# EAGLE design esp32 (EAGLE 9.6.2)
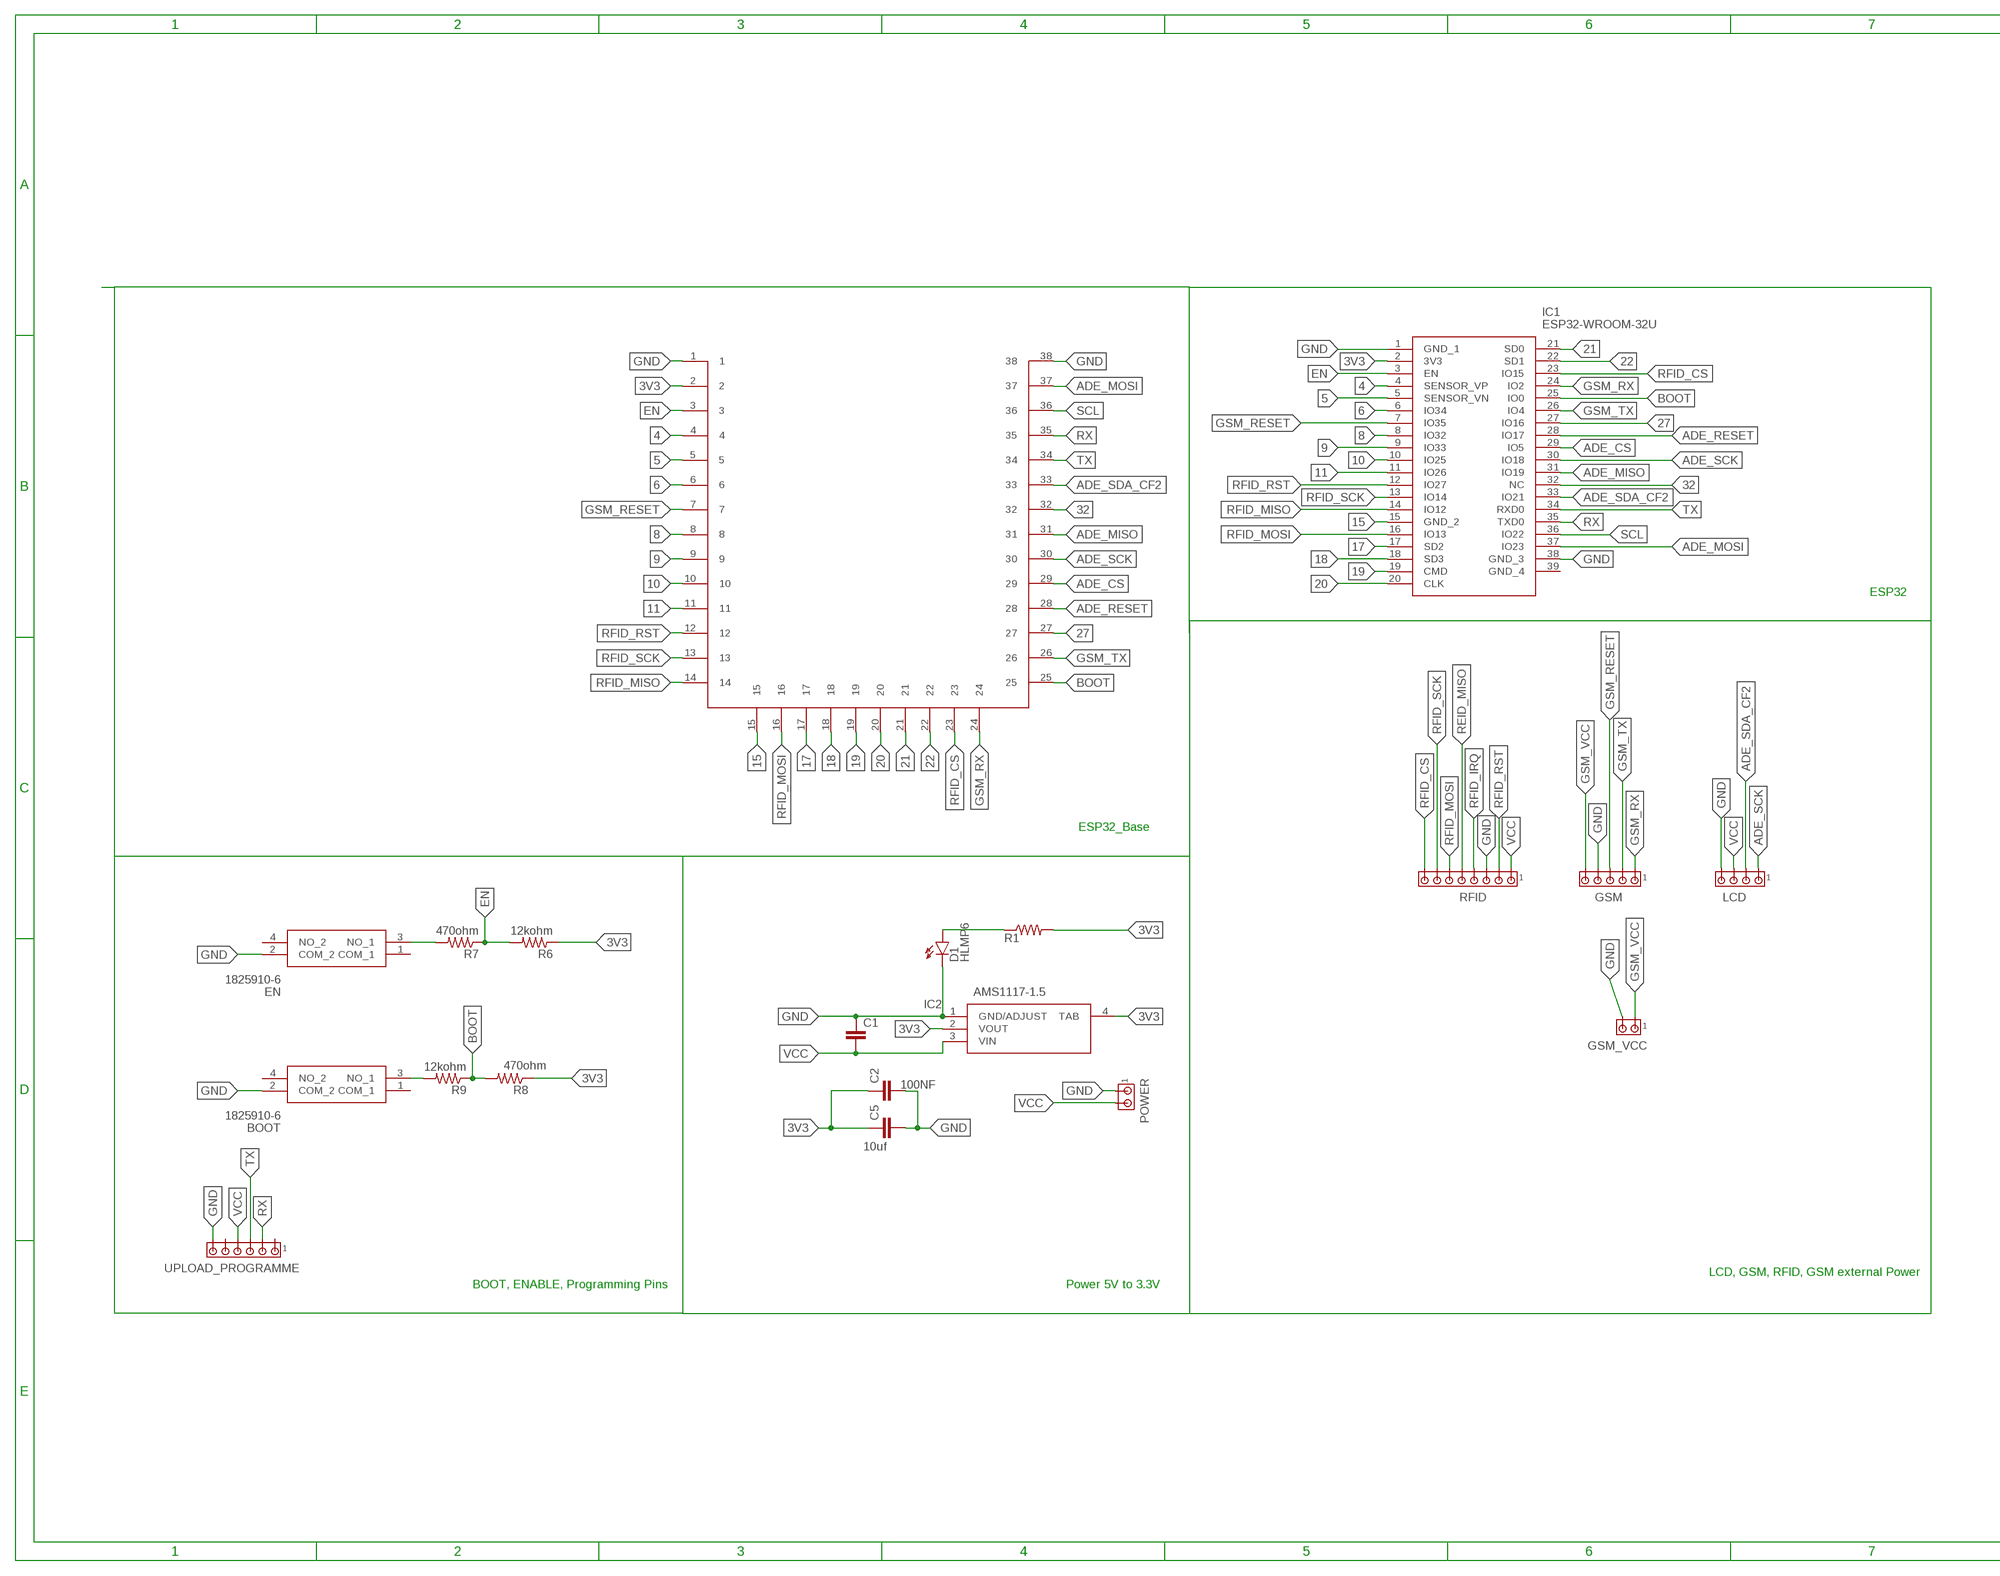
[diagram p0: schematic, sheet 1, part 1 of 2]
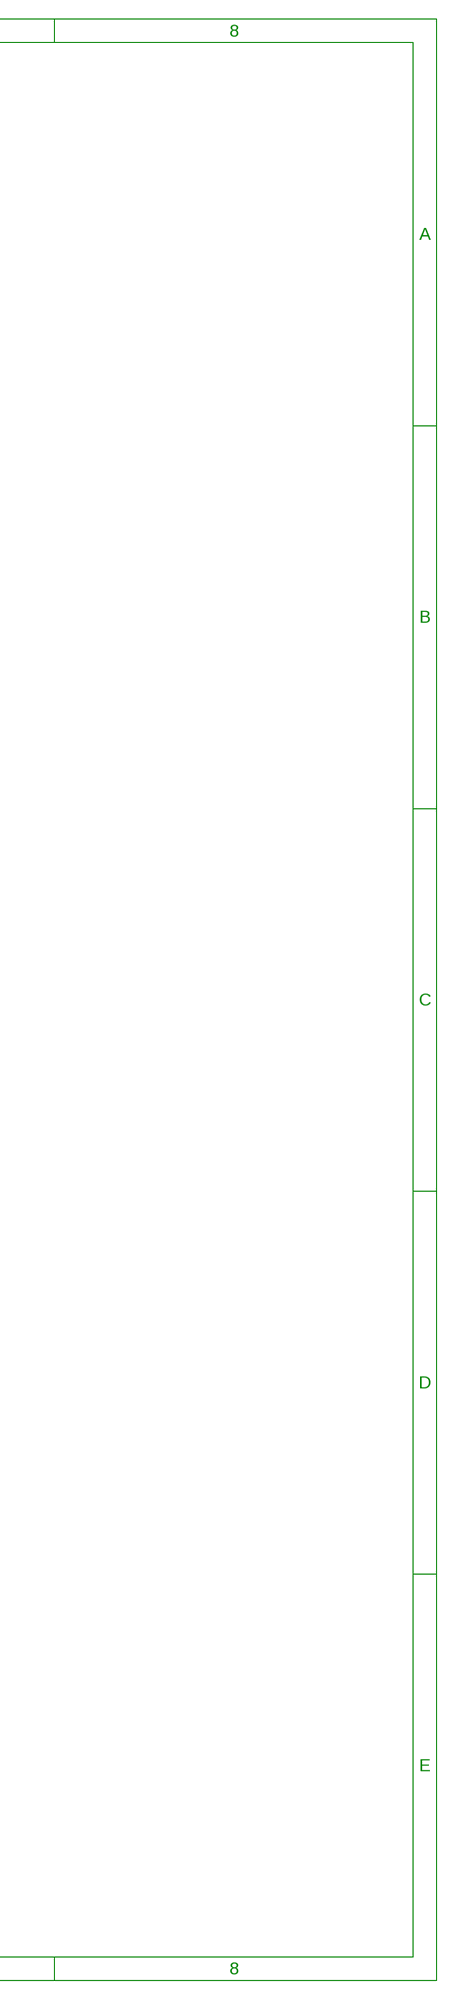
[diagram p1: schematic, sheet 1, part 2 of 2]

## Parts
BOOT  1825910-6  [18259106]
C1  C2,5-3  [C2.5-3]
C2  100NF  C2,5-3  [C2.5-3]
C5  10uf  C2,5-3  [C2.5-3]
D1  HLMP6  [HLMP6]
EN  1825910-6  [18259106]
GSM  MTA05-156  [1X5MTA]
GSM_VCC  MTA02-156  [1X2MTA]
IC1  ESP32-WROOM-32U  [ESP32WROOM32D]
IC2  AMS1117-1.5  [SOT229P700X180-4N]
LCD  MTA04-156  [1X4MTA]
POWER  MTA02-156  [1X2MTA]
R1  R-US_0204/7  [0204/7]
R6  12kohm  2-2176053-0  [RESC2012X65N]
R7  470ohm  2-2176053-0  [RESC2012X65N]
R8  470ohm  2-2176053-0  [RESC2012X65N]
R9  12kohm  2-2176053-0  [RESC2012X65N]
RFID  MTA08-156  [1X8MTA]
U$1  LIB1SHIV_KUMAR  [1X14MTA]
UPLOAD_PROGRAMME  MTA06-156  [1X6MTA]

## Nets
3V3: C2.1 C5.1 IC1.2(3V3) IC2.2(VOUT) IC2.4(TAB) R1.2 R6.1 R8.1 U$1.2
4: IC1.4(SENSOR_VP) U$1.4
5: IC1.5(SENSOR_VN) U$1.5
6: IC1.6(IO34) U$1.6
8: IC1.8(IO32) U$1.8
9: IC1.9(IO33) U$1.9
10: IC1.10(IO25) U$1.10
11: IC1.11(IO26) U$1.11
15: IC1.15(GND_2) U$1.15
17: IC1.17(SD2) U$1.17
18: IC1.18(SD3) U$1.18
19: IC1.19(CMD) U$1.19
20: IC1.20(CLK) U$1.20
21: IC1.21(SD0) U$1.21
22: IC1.22(SD1) U$1.22
27: IC1.27(IO16) U$1.27
32: IC1.32(NC) U$1.32
ADE_CS: IC1.29(IO5) U$1.29
ADE_MISO: IC1.31(IO19) U$1.31
ADE_MOSI: IC1.37(IO23) U$1.37
ADE_RESET: IC1.28(IO17) U$1.28
ADE_SCK: IC1.30(IO18) LCD.1 U$1.30
ADE_SDA_CF2: IC1.33(IO21) LCD.2 U$1.33
BOOT: IC1.25(IO0) R8.2 R9.1 U$1.25
EN: IC1.3(EN) R6.2 R7.1 U$1.3
GND: BOOT.2(COM_2) C1.1 C2.2 C5.2 D1.K EN.2(COM_2) GSM.4 GSM_VCC.2 IC1.1(GND_1) IC1.38(GND_3) IC2.1(GND/ADJUST) LCD.4 POWER.1 RFID.3 U$1.1 U$1.38 UPLOAD_PROGRAMME.6
GSM_RESET: GSM.3 IC1.7(IO35) U$1.7
GSM_RX: GSM.1 IC1.24(IO2) U$1.24
GSM_TX: GSM.2 IC1.26(IO4) U$1.26
GSM_VCC: GSM.5 GSM_VCC.1
N$23: EN.3(NO_1) R7.2
N$39: BOOT.3(NO_1) R9.2
N$41: D1.A R1.1
REID_MISO: RFID.5
RFID_CS: IC1.23(IO15) RFID.8 U$1.23
RFID_IRQ: RFID.4
RFID_MISO: IC1.14(IO12) U$1.14
RFID_MOSI: IC1.16(IO13) RFID.6 U$1.16
RFID_RST: IC1.12(IO27) RFID.2 U$1.12
RFID_SCK: IC1.13(IO14) RFID.7 U$1.13
RX: IC1.35(TXD0) U$1.35 UPLOAD_PROGRAMME.2
SCL: IC1.36(IO22) U$1.36
TX: IC1.34(RXD0) U$1.34 UPLOAD_PROGRAMME.3
VCC: C1.2 IC2.3(VIN) LCD.3 POWER.2 RFID.1 UPLOAD_PROGRAMME.4
Unconnected: BOOT.1(COM_1) BOOT.4(NO_2) EN.1(COM_1) EN.4(NO_2) IC1.39(GND_4) UPLOAD_PROGRAMME.1 UPLOAD_PROGRAMME.5

## Notes on the sheet
- ESP32
- ESP32_Base
- LCD, GSM, RFID, GSM external Power
- BOOT, ENABLE, Programming Pins | Power 5V to 3.3V

## Library data of the parts
BOOT EN = 1825910-6:1825910-6: FSM4JH=6MM TACT SWITCH, HIGH TEMP Source: Datasheet <https://www.te.com/commerce/DocumentDelivery/DDEController?Action=srchrtrv&DocNm=1825910&DocType=Customer Drawing&DocLang=English&DocFormat=pdf&PartCntxt=1825910-6>; ARROW_PART_NUMBER: 1825910-6; ARROW_PRICE-STOCK: https://www.arrow.com/en/products/1825910-6/te-connectivity?region=europe; DESCRIPTION: FSM4JH=6MM TACT SWITCH, HIGH TEMP; HEIGHT: 5.3mm; MANUFACTURER_NAME: TE Connectivity; MANUFACTURER_PART_NUMBER: 1825910-6; MF: ALCOSWITCH - TE CONNECTIVITY; MOUSER_PART_NUMBER: N/A; MOUSER_PRICE-STOCK: https://www.mouser.co.uk/ProductDetail/TE-Connectivity/1825910-6?qs=A6cQTCBcXncisYDS1KbpGA%3D%3D; MPN: FSM4JH; OC_FARNELL: 1555982
C1 C2 C5 = capacitor-wima:C: CAPACITOR naming: grid - package width
D1 = display-hp:HLMP6: LED 2mm horizontal; MF: AGILENT TECHNOLOGIES; MPN: HLMP-6500; OC_FARNELL: 1652490; OC_NEWARK: 40K0088
GSM = con-amp:MTA05-156: AMP connector
GSM_VCC POWER = con-amp:MTA02-156: AMP connector
IC1 = ESP32-WROOM-32U:ESP32-WROOM-32U: WiFi Modules (802.11) SMD Module, ESP32-D0WD, 32Mbits SPI flash, UART mode, U.FL antenna connector Source: Datasheet <https://www.mouser.de/datasheet/2/891/esp32-wroom-32d_esp32-wroom-32u_datasheet_en-1365844.pdf>; DESCRIPTION: WiFi Modules (802.11) SMD Module, ESP32-D0WD, 32Mbits SPI flash, UART mode, U.FL antenna connector; HEIGHT: 3.1mm; MANUFACTURER_NAME: Espressif Systems; MANUFACTURER_PART_NUMBER: ESP32-WROOM-32U; MOUSER_PART_NUMBER: 356-ESP32-WROOM-32U; OC_FARNELL: unknown
IC2 = AMS1117-1.5:AMS1117-1.5: 1A LOW DROPOUT VOLTAGE REGULATOR Source: Datasheet <http://www.advanced-monolithic.com/pdf/ds1117.pdf>; DESCRIPTION: 1A LOW DROPOUT VOLTAGE REGULATOR; HEIGHT: 1.8mm; MANUFACTURER_NAME: ams; MANUFACTURER_PART_NUMBER: AMS1117-1.5; OC_FARNELL: unknown
LCD = con-amp:MTA04-156: AMP connector
R1 = rcl:R-US_: RESISTOR, American symbol; SPICEPREFIX: R
R6-R9 = 2-2176053-0:2-2176053-0: RLP73N 2A R33 1% 1K RL Check availability <https://pricing.snapeda.com/parts/2-2176053-0/TE%20Connectivity/view-part?ref=eda>; AVAILABILITY: In Stock; COMMENT: 2-2176053-0; DESCRIPTION: RES 0.33 OHM 1% 1/4W 0805; EU_ROHS_COMPLIANCE: Compliant with Exemptions; MF: TE Connectivity; MP: 2-2176053-0; PACKAGE: 0805; PRICE: None
RFID = con-amp:MTA08-156: AMP connector
U$1 = ESP_CONN:LIB1
UPLOAD_PROGRAMME = con-amp:MTA06-156: AMP connector

## Board
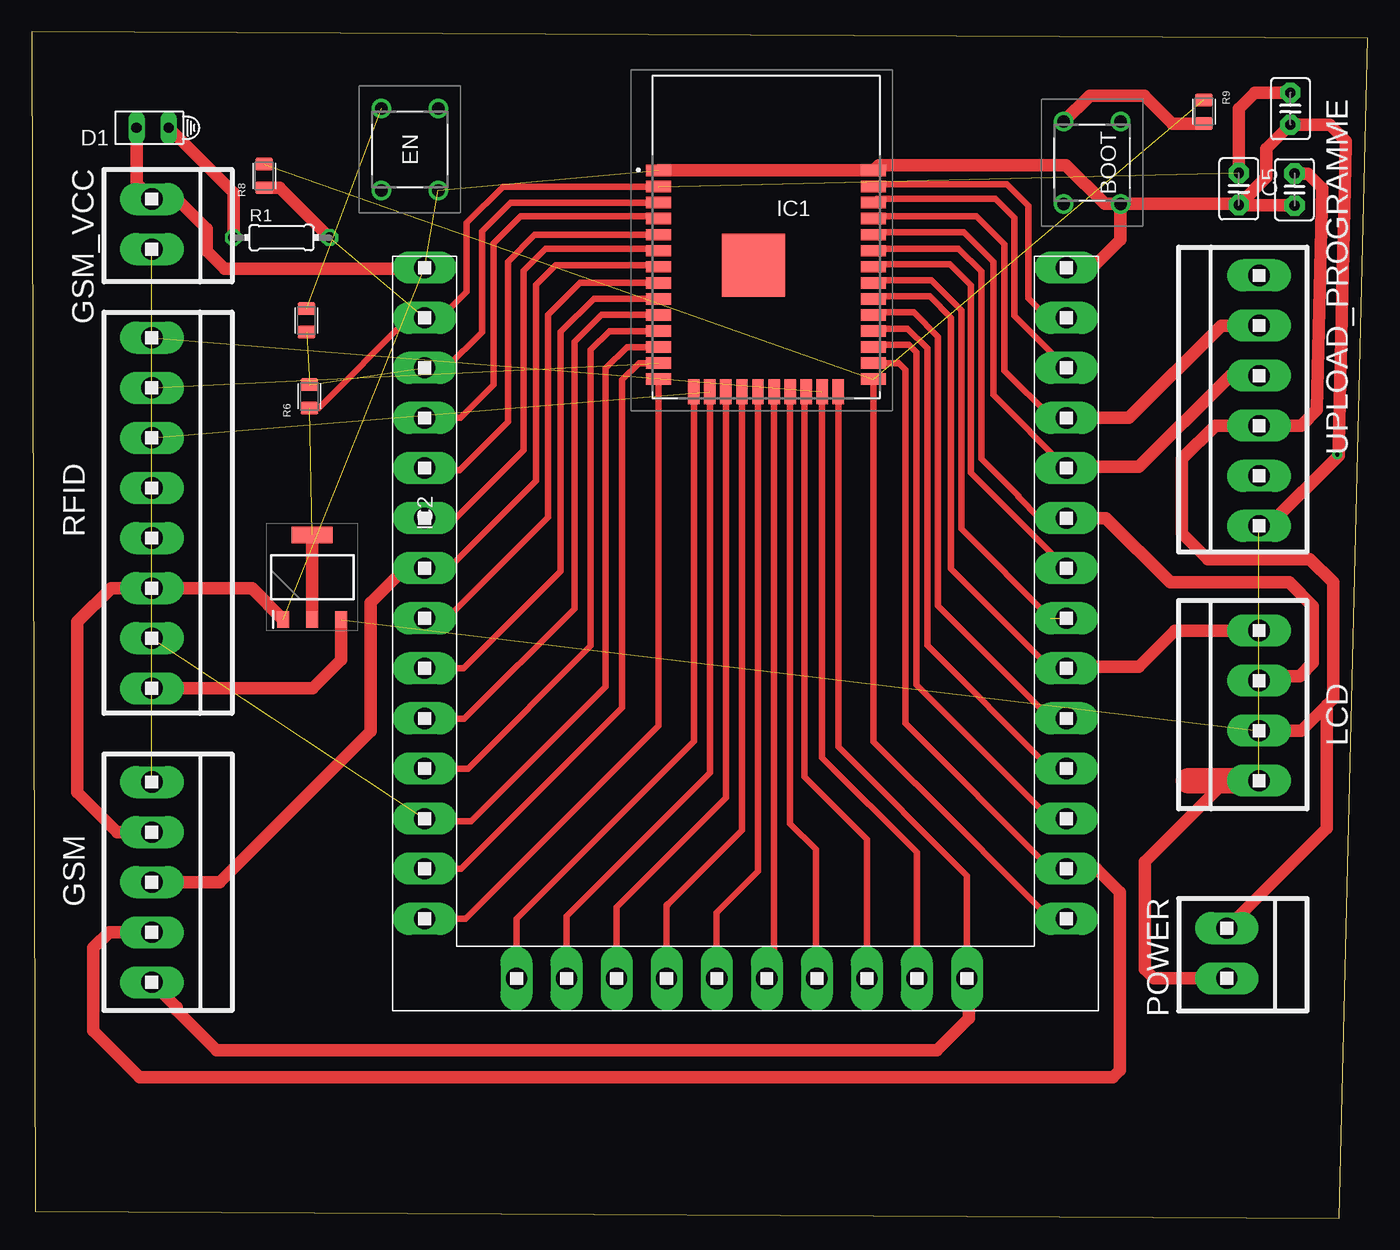
[diagram p2: board, top side]

Size 105.77 x 93.87 mm. Coordinates in mm from the lower left corner, seen from the top.
Outline: 0.27,0.54 103.5,0 105.77,93.33 0,93.87 0.27,0.54
Copper layers (1*16): Top 0.035mm / dielectric 1.5mm / Bottom 0.035mm
Design rules "default": minimum track width 6mil, minimum drill 0.35mm, track to track 6mil, track to pad 6mil, pad to pad 6mil, via to via 6mil, smd to smd 6mil, copper to edge 40mil, drill to drill 6mil, minimum pad ring 10mil, minimum via ring 8mil, stop-mask expansion 4mil, vias tented up to drill 0mil, thermal gap 10mil

### Footprints (pad centres in the part's own frame; a part is rotated, then mirrored left to right if it is on the bottom)
18259106 = drill 0.99 pad 1.54: 1 0,0; 2 6.5,0; 3 0,-4.5; 4 6.5,-4.5
C2.5-3 = drill 0.813 pad 1.6 octagon: 1 -1.27,0; 2 1.27,0
HLMP6 = drill 0.813 long: A -1.27,0; K 1.27,0
1X5MTA = drill 1.676 long: 1 7.925,0; 2 3.962,0; 3 0,0; 4 -3.962,0; 5 -7.925,0
1X2MTA = drill 1.676 long: 1 1.981,0; 2 -1.981,0
ESP32WROOM32D = smd 2 x 0.9: 1 -8.15,5.51; 2 -8.15,4.24; 3 -8.15,2.97; 4 -8.15,1.7; 5 -8.15,0.43; 6 -8.15,-0.84; 7 -8.15,-2.11; 8 -8.15,-3.38; 9 -8.15,-4.65; 10 -8.15,-5.92; 11 -8.15,-7.19; 12 -8.15,-8.46; 13 -8.15,-9.73; 14 -8.15,-11; 25 8.85,-11; 26 8.85,-9.73; 27 8.85,-8.46; 28 8.85,-7.19; 29 8.85,-5.92; 30 8.85,-4.65; 31 8.85,-3.38; 32 8.85,-2.11; 33 8.85,-0.84; 34 8.85,0.43; 35 8.85,1.7; 36 8.85,2.97; 37 8.85,4.24; 38 8.85,5.51 | smd 0.9 x 2: 15 -5.365,-12; 16 -4.095,-12; 17 -2.825,-12; 18 -1.555,-12; 19 -0.285,-12; 20 0.985,-12; 21 2.255,-12; 22 3.525,-12; 23 4.795,-12; 24 6.065,-12 | smd 5 x 5: 39 -0.65,-1.99
SOT229P700X180-4N = smd 1.3 x 0.95: 1 -3.35,2.29; 2 -3.35,0; 3 -3.35,-2.29 | smd 1.3 x 3.25: 4 3.35,0
1X4MTA = drill 1.676 long: 1 5.944,0; 2 1.981,0; 3 -1.981,0; 4 -5.944,0
0204/7 = drill 0.813 octagon: 1 -3.81,0; 2 3.81,0
RESC2012X65N = smd 1 x 1.42: 1 -0.935,0; 2 0.935,0
1X8MTA = drill 1.676 long: 1 13.868,0; 2 9.906,0; 3 5.944,0; 4 1.981,0; 5 -1.981,0; 6 -5.944,0; 7 -9.906,0; 8 -13.868,0
1X14MTA = drill 1.676 long: 1 -27.94,23.216; 2 -27.94,19.253; 3 -27.94,15.291; 4 -27.94,11.328; 5 -27.94,7.366; 6 -27.94,3.404; 7 -27.94,-0.559; 8 -27.94,-4.521; 9 -27.94,-8.484; 10 -27.94,-12.446; 11 -27.94,-16.408; 12 -27.94,-20.371; 13 -27.94,-24.333; 14 -27.94,-28.296; 15 -20.676,-33.02; 16 -16.713,-33.02; 17 -12.751,-33.02; 18 -8.788,-33.02; 19 -4.826,-33.02; 20 -0.864,-33.02; 21 3.099,-33.02; 22 7.061,-33.02; 23 11.024,-33.02; 24 14.986,-33.02; 25 22.86,-28.296; 26 22.86,-24.333; 27 22.86,-20.371; 28 22.86,-16.408; 29 22.86,-12.446; 30 22.86,-8.484; 31 22.86,-4.521; 32 22.86,-0.559; 33 22.86,3.404; 34 22.86,7.366; 35 22.86,11.328; 36 22.86,15.291; 37 22.86,19.253; 38 22.86,23.216
1X6MTA = drill 1.676 long: 1 9.906,0; 2 5.944,0; 3 1.981,0; 4 -1.981,0; 5 -5.944,0; 6 -9.906,0

### Placement (x,y rotation side)
BOOT  86.18,86.74 270 top
C1  99.96,81.37 90 top
C2  99.63,87.77 270 top
C5  95.55,81.42 270 top
D1  9.58,86.26 180 top
EN  32.19,87.8 270 top
GSM  9.52,26.57 270 top
GSM_VCC  9.52,78.64 270 top
IC1  57.78,77.37 0 top
IC2  22.22,50.7 90 top
LCD  97.15,40.54 90 top
POWER  94.6,20.95 270 top
R1  19.79,77.57 0 top
R6  21.99,65.01 90 top
R7  21.76,71.02 90 top
R8  18.41,82.45 90 top
R9  92.79,87.53 270 top
RFID  9.52,55.78 270 top
U$1  59.05,51.97 0 top
UPLOAD_PROGRAMME  97.15,64.67 90 top

### Tracks (layer width: path | path; a pad name or v marks a point on that pad's centre or on a via)
3V3  (3 unrouted)
  Top 0.5: IC1.2 37.3,81.61 34.44,78.75 34.44,73.3 32.37,71.22 U$1.2 29.85,71.22 22.7,64.08 R6.1
  Top 1: C2.1 96.81,89.04 95.55,87.78 C5.1 | IC2.2 IC2.4 | R8.1 19.65,81.52 R1.2
4
  Top 0.5: IC1.4 49.56,79.07 49.38,79.24 38.7,79.24 36.58,77.12 36.58,65.94 33.94,63.3 U$1.4
5
  Top 0.5: IC1.5 39.83,77.8 37.7,75.68 37.7,63 33.86,59.16 30.62,59.16 30.8,59.34 U$1.5
6
  Top 0.5: IC1.6 49.47,76.69 40.67,76.69 38.95,74.96 38.95,60.74 33.53,55.33 30.57,55.33 30.61,55.37 U$1.6
8
  Top 0.5: IC1.8 43.39,73.99 40.87,71.47 40.87,55.45 32.76,47.34 31.22,47.34 U$1.8
9
  Top 0.5: IC1.9 44.5,72.72 41.89,70.11 41.89,51.16 34.21,43.49 U$1.9
10
  Top 0.5: IC1.10 45.1,71.45 42.98,69.33 42.98,48.22 34.24,39.49 31.15,39.49 U$1.10
11
  Top 0.5: IC1.11 45.75,70.18 44.25,68.68 44.25,45.27 34.53,35.55 31.13,35.55 U$1.11
15
  Top 0.5: IC1.15 52.41,37.72 38.37,23.68 U$1.15
17
  Top 0.5: IC1.17 54.95,33.24 46.3,24.58 U$1.17
18
  Top 0.5: IC1.18 56.22,30.69 50.41,24.88 50.26,24.73 | 50.24,20.1 50.24,24.7 50.26,24.73 | U$1.18 50.26,24.73
19
  Top 0.5: IC1.19 57.5,27.43 54.22,24.16 U$1.19
20
  Top 0.5: IC1.20 58.77,19.53 U$1.20
21
  Top 0.5: IC1.21 60.03,31.19 62.07,29.16 62.07,19.03 U$1.21
22
  Top 0.5: IC1.22 61.18,65.25 61.18,34.91 66.11,29.99 U$1.22
27
  Top 0.5: IC1.27 66.82,69.1 69.42,69.1 70.05,68.48 70.05,42.21 80.65,31.6 U$1.27
32
  Top 0.5: IC1.32 66.83,75.46 72.68,75.46 74.35,73.79 74.35,58.97 U$1.32
ADE_CS
  Top 0.5: IC1.29 66.83,71.65 69.83,71.65 71.75,69.73 71.75,48.43 80.65,39.52 U$1.29
ADE_MISO  (1 unrouted)
  Top 0.5: IC1.31 66.83,74.2 71.21,74.2 73.58,71.82 73.58,54.52 80.65,47.45 U$1.31
ADE_MOSI
  Top 0.5: IC1.37 66.83,81.81 77.18,81.81 78.89,80.09 78.89,72.77 80.44,71.22 U$1.37
ADE_RESET
  Top 0.5: IC1.28 66.83,70.38 69.33,70.38 70.89,68.81 70.89,45.32 80.65,35.56 U$1.28
ADE_SCK
  Top 0.5: IC1.30 66.83,72.92 71.09,72.92 72.76,71.25 72.76,51.38 80.65,43.49 U$1.30
  Top 1: U$1.30 82.05,43.62 87.64,43.62 90.5,46.48 LCD.1
ADE_SDA_CF2
  Top 0.5: IC1.33 66.81,76.71 73.38,76.71 75.17,74.91 75.17,60.08 78.1,57.15 78.1,57.05 79.78,55.37 81.51,55.37 U$1.33
  Top 1: LCD.2 97.49,42.86 100.36,42.86 101.42,43.92 101.42,48.4 99.54,50.28 90.11,50.28 85.02,55.37 81.51,55.37
BOOT  (2 unrouted)
  Top 0.5: IC1.25 66.63,37.69 69.93,34.39 69.94,34.39 80.65,23.67 U$1.25
EN  (2 unrouted)
  Top 0.5: 49.63,80.26 IC1.3 37.9,80.34 35.64,78.08 35.64,70.09 32.81,67.26 U$1.3
GND  (4 unrouted)
  Top 0.5: 66.71,82.88 IC1.38 IC1.1
  Top 0.813: 66.71,82.88 66.88,82.88
  Top 1: IC1.1 66.71,82.88 | IC1.38 67.05,83.3 81.88,83.3 84.94,80.24 BOOT.2 | U$1.38 83.95,75.19 86.18,77.41 BOOT.2 | BOOT.2 95.46,80.24 C5.2 | C5.2 99.91,80.15 C1.1 | C5.2 97.73,82.33 97.73,84.61 C2.2 102.77,86.5 103.53,85.7 104.03,85.2 104.03,84.93 103.45,61.19 103.45,60.33 97.89,54.76 UPLOAD_PROGRAMME.6 | POWER.1 88.84,18.97 88.11,19.7 88.11,28.19 94.52,34.6 LCD.4 | GSM.4 6.77,30.53 3.63,33.67 3.63,47.17 6.29,49.84 RFID.3 17.44,49.84 IC2.1 | D1.K 8.31,81.83 GSM_VCC.2 11.54,80.62 13.88,78.28 13.88,76.52 15.3,75.1 31.02,75.1 U$1.1
  Top 2: LCD.4 91.57,34.6
GSM_RESET
  Top 0.5: IC1.7 49.49,75.4 41.46,75.4 39.91,73.86 39.91,58.31 33.01,51.41 U$1.7
  Top 1: GSM.3 14.9,26.57 26.82,38.49 26.82,48.68 29.55,51.41 U$1.7
GSM_RX
  Top 0.5: IC1.24 63.84,37.29 74.04,27.1 U$1.24
  Top 1: GSM.1 11.48,16.69 11.48,16.43 14.64,13.27 71.66,13.27 74.21,15.81 74.21,18.78 U$1.24
GSM_TX
  Top 0.5: IC1.26 68.6,67.64 68.61,67.66 | 68.61,67.66 | 68.61,67.66 69.15,67.12 69.15,39.14 80.65,27.64 81.63,27.64 U$1.26
  Top 1: GSM.2 6.13,22.61 4.9,21.38 4.9,14.8 8.57,11.12 85.59,11.12 86.15,11.68 86.15,25.76 84.28,27.64 81.63,27.64
GSM_VCC  (1 unrouted)
N$3  (via drill 0.35)
  other vias: 103.34,60.43
N$23  (1 unrouted)
N$39
  Top 1: BOOT.3 83.75,88.81 88.06,88.81 90.27,86.59 R9.2
N$41
  Top 1: D1.A 15.98,81.13 R1.1
RFID_CS  (1 unrouted)
  Top 0.5: IC1.23 62.58,36.44 70.07,28.94 U$1.23
RFID_MISO
  Top 0.5: IC1.14 49.63,38.94 34.37,23.67 U$1.14
RFID_MOSI  (1 unrouted)
  Top 0.5: IC1.16 53.69,35.23 42.34,23.88 U$1.16
RFID_RST  (1 unrouted)
  Top 0.5: IC1.12 47.11,68.91 45.44,67.24 45.44,42.04 34.78,31.38 31.33,31.38 U$1.12
RFID_SCK  (1 unrouted)
  Top 0.5: IC1.13 48.07,67.64 46.74,66.32 46.74,40.37 34.01,27.64 U$1.13
RX
  Top 0.5: U$1.35 80.74,63.3 76.99,67.05 76.99,77.03 74.77,79.25 66.81,79.25 IC1.35
  Top 1: U$1.35 86.84,63.3 94.16,70.61 UPLOAD_PROGRAMME.2
SCL
  Top 0.5: IC1.36 66.93,80.64 76.28,80.64 77.78,79.14 77.78,71.39 U$1.36
TX
  Top 0.5: U$1.34 76.12,65.12 76.12,75.66 73.8,77.98 66.81,77.98 IC1.34
  Top 1: U$1.34 82,59.42 87.66,59.42 94.69,66.45 94.69,66.46 94.88,66.65 UPLOAD_PROGRAMME.3
VCC  (1 unrouted)
  Top 1: C1.2 101,82.64 102.17,81.47 101.74,63.94 100.49,62.69 UPLOAD_PROGRAMME.4 93.68,62.69 91.05,60.07 91.05,54.17 93.12,52.11 101.19,52.11 103.01,50.28 103.01,41.07 102.52,40.58 | LCD.3 100.5,38.56 102.52,40.58 | POWER.2 102.52,30.85 102.52,40.58 | RFID.1 22.24,41.91 24.51,44.18 IC2.3